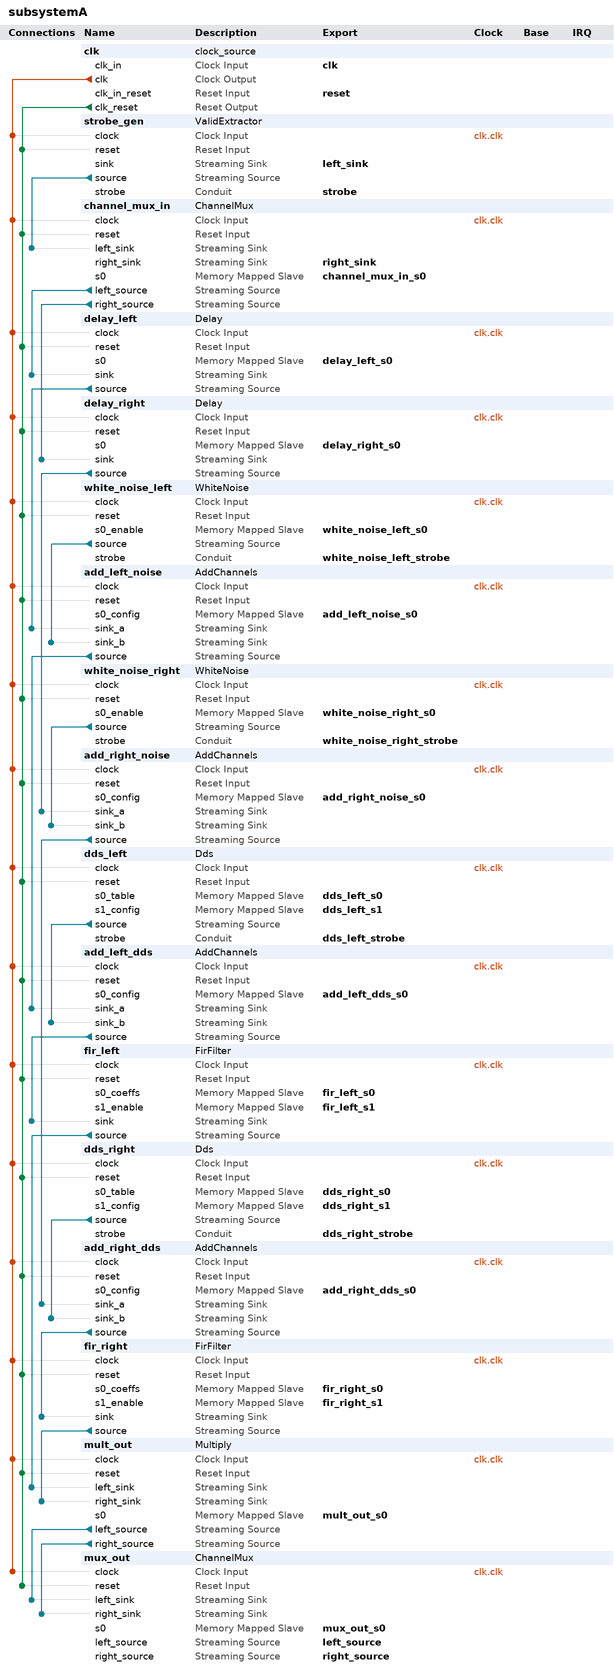
[diagram p0: system contents]
# Platform Designer (Qsys) system subsystemA, Cyclone V 5CSEMA5F31C6
# Parameters at their usual value, and those the tool derives, are not listed.
package require -exact qsys 17.1
create_system subsystemA
set_project_property DEVICE_FAMILY {Cyclone V}
set_project_property DEVICE 5CSEMA5F31C6

add_instance clk clock_source 17.1
set_instance_parameter_value clk clockFrequency 50000000

add_instance strobe_gen ValidExtractor 1.0
set_instance_parameter_value strobe_gen data_width_g 24

add_instance channel_mux_in ChannelMux 1.0
set_instance_parameter_value channel_mux_in gDataWidth 24

add_instance delay_left Delay 1.0
set_instance_parameter_value delay_left gDataWidth 24
set_instance_parameter_value delay_left gMaxDelay 1024

add_instance delay_right Delay 1.0
set_instance_parameter_value delay_right gDataWidth 24
set_instance_parameter_value delay_right gMaxDelay 1024

add_instance white_noise_left WhiteNoise 1.0
set_instance_parameter_value white_noise_left data_width_g 24
set_instance_parameter_value white_noise_left lfsr_length_g 24

add_instance add_left_noise AddChannels 1.0
set_instance_parameter_value add_left_noise data_width_g 24

add_instance white_noise_right WhiteNoise 1.0
set_instance_parameter_value white_noise_right data_width_g 24
set_instance_parameter_value white_noise_right lfsr_length_g 24

add_instance add_right_noise AddChannels 1.0
set_instance_parameter_value add_right_noise data_width_g 24

add_instance dds_left Dds 1.0
set_instance_parameter_value dds_left data_width_g 24
set_instance_parameter_value dds_left phase_bits_g 20
set_instance_parameter_value dds_left phase_dither_g 8
set_instance_parameter_value dds_left wave_table_width_g 24

add_instance add_left_dds AddChannels 1.0
set_instance_parameter_value add_left_dds data_width_g 24

add_instance fir_left FirFilter 1.0
set_instance_parameter_value fir_left coeff_num_g 128
set_instance_parameter_value fir_left data_width_g 24

add_instance dds_right Dds 1.0
set_instance_parameter_value dds_right data_width_g 24
set_instance_parameter_value dds_right phase_bits_g 20
set_instance_parameter_value dds_right phase_dither_g 8
set_instance_parameter_value dds_right wave_table_width_g 24

add_instance add_right_dds AddChannels 1.0
set_instance_parameter_value add_right_dds data_width_g 24

add_instance fir_right FirFilter 1.0
set_instance_parameter_value fir_right coeff_num_g 128
set_instance_parameter_value fir_right data_width_g 24

add_instance mult_out Multiply 1.0
set_instance_parameter_value mult_out data_width_g 24

add_instance mux_out ChannelMux 1.0
set_instance_parameter_value mux_out gDataWidth 24

# connections
add_connection clk.clk add_left_dds.clock clock
add_connection clk.clk add_left_noise.clock clock
add_connection clk.clk add_right_dds.clock clock
add_connection clk.clk add_right_noise.clock clock
add_connection clk.clk channel_mux_in.clock clock
add_connection clk.clk dds_left.clock clock
add_connection clk.clk dds_right.clock clock
add_connection clk.clk delay_left.clock clock
add_connection clk.clk delay_right.clock clock
add_connection clk.clk fir_left.clock clock
add_connection clk.clk fir_right.clock clock
add_connection clk.clk mult_out.clock clock
add_connection clk.clk mux_out.clock clock
add_connection clk.clk strobe_gen.clock clock
add_connection clk.clk white_noise_left.clock clock
add_connection clk.clk white_noise_right.clock clock
add_connection clk.clk_reset add_left_dds.reset reset
add_connection clk.clk_reset add_left_noise.reset reset
add_connection clk.clk_reset add_right_dds.reset reset
add_connection clk.clk_reset add_right_noise.reset reset
add_connection clk.clk_reset channel_mux_in.reset reset
add_connection clk.clk_reset dds_left.reset reset
add_connection clk.clk_reset dds_right.reset reset
add_connection clk.clk_reset delay_left.reset reset
add_connection clk.clk_reset delay_right.reset reset
add_connection clk.clk_reset fir_left.reset reset
add_connection clk.clk_reset fir_right.reset reset
add_connection clk.clk_reset mult_out.reset reset
add_connection clk.clk_reset mux_out.reset reset
add_connection clk.clk_reset strobe_gen.reset reset
add_connection clk.clk_reset white_noise_left.reset reset
add_connection clk.clk_reset white_noise_right.reset reset
add_connection add_left_dds.source fir_left.sink avalon_streaming
add_connection add_left_noise.source add_left_dds.sink_a avalon_streaming
add_connection add_right_dds.source fir_right.sink avalon_streaming
add_connection add_right_noise.source add_right_dds.sink_a avalon_streaming
add_connection channel_mux_in.left_source delay_left.sink avalon_streaming
add_connection channel_mux_in.right_source delay_right.sink avalon_streaming
add_connection dds_left.source add_left_dds.sink_b avalon_streaming
add_connection dds_right.source add_right_dds.sink_b avalon_streaming
add_connection delay_left.source add_left_noise.sink_a avalon_streaming
add_connection delay_right.source add_right_noise.sink_a avalon_streaming
add_connection fir_left.source mult_out.left_sink avalon_streaming
add_connection fir_right.source mult_out.right_sink avalon_streaming
add_connection mult_out.left_source mux_out.left_sink avalon_streaming
add_connection mult_out.right_source mux_out.right_sink avalon_streaming
add_connection strobe_gen.source channel_mux_in.left_sink avalon_streaming
add_connection white_noise_left.source add_left_noise.sink_b avalon_streaming
add_connection white_noise_right.source add_right_noise.sink_b avalon_streaming

# exported interfaces
add_interface add_left_dds_s0 avalon slave
set_interface_property add_left_dds_s0 EXPORT_OF add_left_dds.s0_config
add_interface add_left_noise_s0 avalon slave
set_interface_property add_left_noise_s0 EXPORT_OF add_left_noise.s0_config
add_interface add_right_dds_s0 avalon slave
set_interface_property add_right_dds_s0 EXPORT_OF add_right_dds.s0_config
add_interface add_right_noise_s0 avalon slave
set_interface_property add_right_noise_s0 EXPORT_OF add_right_noise.s0_config
add_interface channel_mux_in_s0 avalon slave
set_interface_property channel_mux_in_s0 EXPORT_OF channel_mux_in.s0
add_interface clk clock sink
set_interface_property clk EXPORT_OF clk.clk_in
add_interface dds_left_s0 avalon slave
set_interface_property dds_left_s0 EXPORT_OF dds_left.s0_table
add_interface dds_left_s1 avalon slave
set_interface_property dds_left_s1 EXPORT_OF dds_left.s1_config
add_interface dds_left_strobe conduit end
set_interface_property dds_left_strobe EXPORT_OF dds_left.strobe
add_interface dds_right_s0 avalon slave
set_interface_property dds_right_s0 EXPORT_OF dds_right.s0_table
add_interface dds_right_s1 avalon slave
set_interface_property dds_right_s1 EXPORT_OF dds_right.s1_config
add_interface dds_right_strobe conduit end
set_interface_property dds_right_strobe EXPORT_OF dds_right.strobe
add_interface delay_left_s0 avalon slave
set_interface_property delay_left_s0 EXPORT_OF delay_left.s0
add_interface delay_right_s0 avalon slave
set_interface_property delay_right_s0 EXPORT_OF delay_right.s0
add_interface fir_left_s0 avalon slave
set_interface_property fir_left_s0 EXPORT_OF fir_left.s0_coeffs
add_interface fir_left_s1 avalon slave
set_interface_property fir_left_s1 EXPORT_OF fir_left.s1_enable
add_interface fir_right_s0 avalon slave
set_interface_property fir_right_s0 EXPORT_OF fir_right.s0_coeffs
add_interface fir_right_s1 avalon slave
set_interface_property fir_right_s1 EXPORT_OF fir_right.s1_enable
add_interface left_sink avalon_streaming sink
set_interface_property left_sink EXPORT_OF strobe_gen.sink
add_interface left_source avalon_streaming source
set_interface_property left_source EXPORT_OF mux_out.left_source
add_interface mult_out_s0 avalon slave
set_interface_property mult_out_s0 EXPORT_OF mult_out.s0
add_interface mux_out_s0 avalon slave
set_interface_property mux_out_s0 EXPORT_OF mux_out.s0
add_interface reset reset sink
set_interface_property reset EXPORT_OF clk.clk_in_reset
add_interface right_sink avalon_streaming sink
set_interface_property right_sink EXPORT_OF channel_mux_in.right_sink
add_interface right_source avalon_streaming source
set_interface_property right_source EXPORT_OF mux_out.right_source
add_interface strobe conduit end
set_interface_property strobe EXPORT_OF strobe_gen.strobe
add_interface white_noise_left_s0 avalon slave
set_interface_property white_noise_left_s0 EXPORT_OF white_noise_left.s0_enable
add_interface white_noise_left_strobe conduit end
set_interface_property white_noise_left_strobe EXPORT_OF white_noise_left.strobe
add_interface white_noise_right_s0 avalon slave
set_interface_property white_noise_right_s0 EXPORT_OF white_noise_right.s0_enable
add_interface white_noise_right_strobe conduit end
set_interface_property white_noise_right_strobe EXPORT_OF white_noise_right.strobe

set_interconnect_requirement {$system} qsys_mm.clockCrossingAdapter HANDSHAKE
set_interconnect_requirement {$system} qsys_mm.enableEccProtection FALSE
set_interconnect_requirement {$system} qsys_mm.insertDefaultSlave FALSE
set_interconnect_requirement {$system} qsys_mm.maxAdditionalLatency 1

save_system subsystemA.qsys
